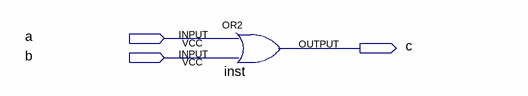
[diagram p0: schematic sheet]
// Quartus schematic or_el.bdf as structural Verilog: 1 symbols, 3 pins
module or_el (
  input  a,
  input  b,
  output c
);

  or inst (c, a, b);
endmodule
